# Altium schematic sheet Sheet1.SchDoc: Projet M1 2024
size A4; DrawnBy: J.CLEMENT & D.FOURNIER; DocumentNumber: 1; Revision: V1.0 Rev A; SheetNumber: 2; SheetTotal: 5
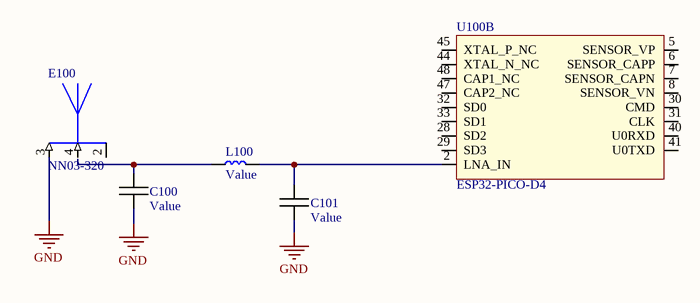
[diagram p0: Sheet1.SchDoc]

## Parts
C100  Value  [CAPC1005X06N]
C101  Value  [CAPC1005X06N]
E100  NN03-320  [XCVR_NN03-320]
L100  Value  [LQPC1005X06N]
U100  ESP32-PICO-D4  [PQFN50P700X700X104_HS-49N]  (part B of 3)

## Nets
GND: C100.2 C101.2 E100.3(FEED_BLUETOOTH)
NetC100_1: C100.1 L100.1
NetC101_1: C101.1 L100.2 U100.2(LNA_IN)

Not connected (* = marked no-connect by the designer): E100 2(GROUND) 4(FEED_GNSS); U100 5(SENSOR_VP) 6(SENSOR_CAPP) 7(SENSOR_CAPN) 8(SENSOR_VN) 28(SD2) 29(SD3) 30(CMD) 31(CLK) 32(SD0) 33(SD1) 40(U0RXD) 41(U0TXD) 44(XTAL_N_NC) 45(XTAL_P_NC) 47(CAP2_NC) 48(CAP1_NC)

## Library data of the parts
C100 C101 = Capacitor
E100 = NN03-320: Dual port antenna booster for GNSS, Bluetooth, 5G and UWB (1561 - 1606MHz, 2400 - 2500MHz, 3400 - 3800MHz, 3100 - 4800MHz and 6000 - 10600 MHz), signal booster; Manufacturer_Name: Ignion; Manufacturer_Part_Number: NN03-320; Mouser Part Number: 128-NN03-320
L100 = Bobine
U100 = ESP32: Système RF sur puce - SoC SIP module ESP32 with 4MByte Flash, Dual Core MCU, Wi-Fi & Bluetooth Combo, LGA48-pin, 7*7mm; Manufacturer 1: Espressif Systems; Supplier 1: Digi-Key; Supplier Part Number 1: 1904-1029-1-ND; Manufacturer Part Number 1: ESP32-PICO-D4